# EasyEDA Pro project ProPrj_台灯_2024-11-13.epro

# Schematic Schematic1
Board Name: Board1; Create Date: 2024-10-06
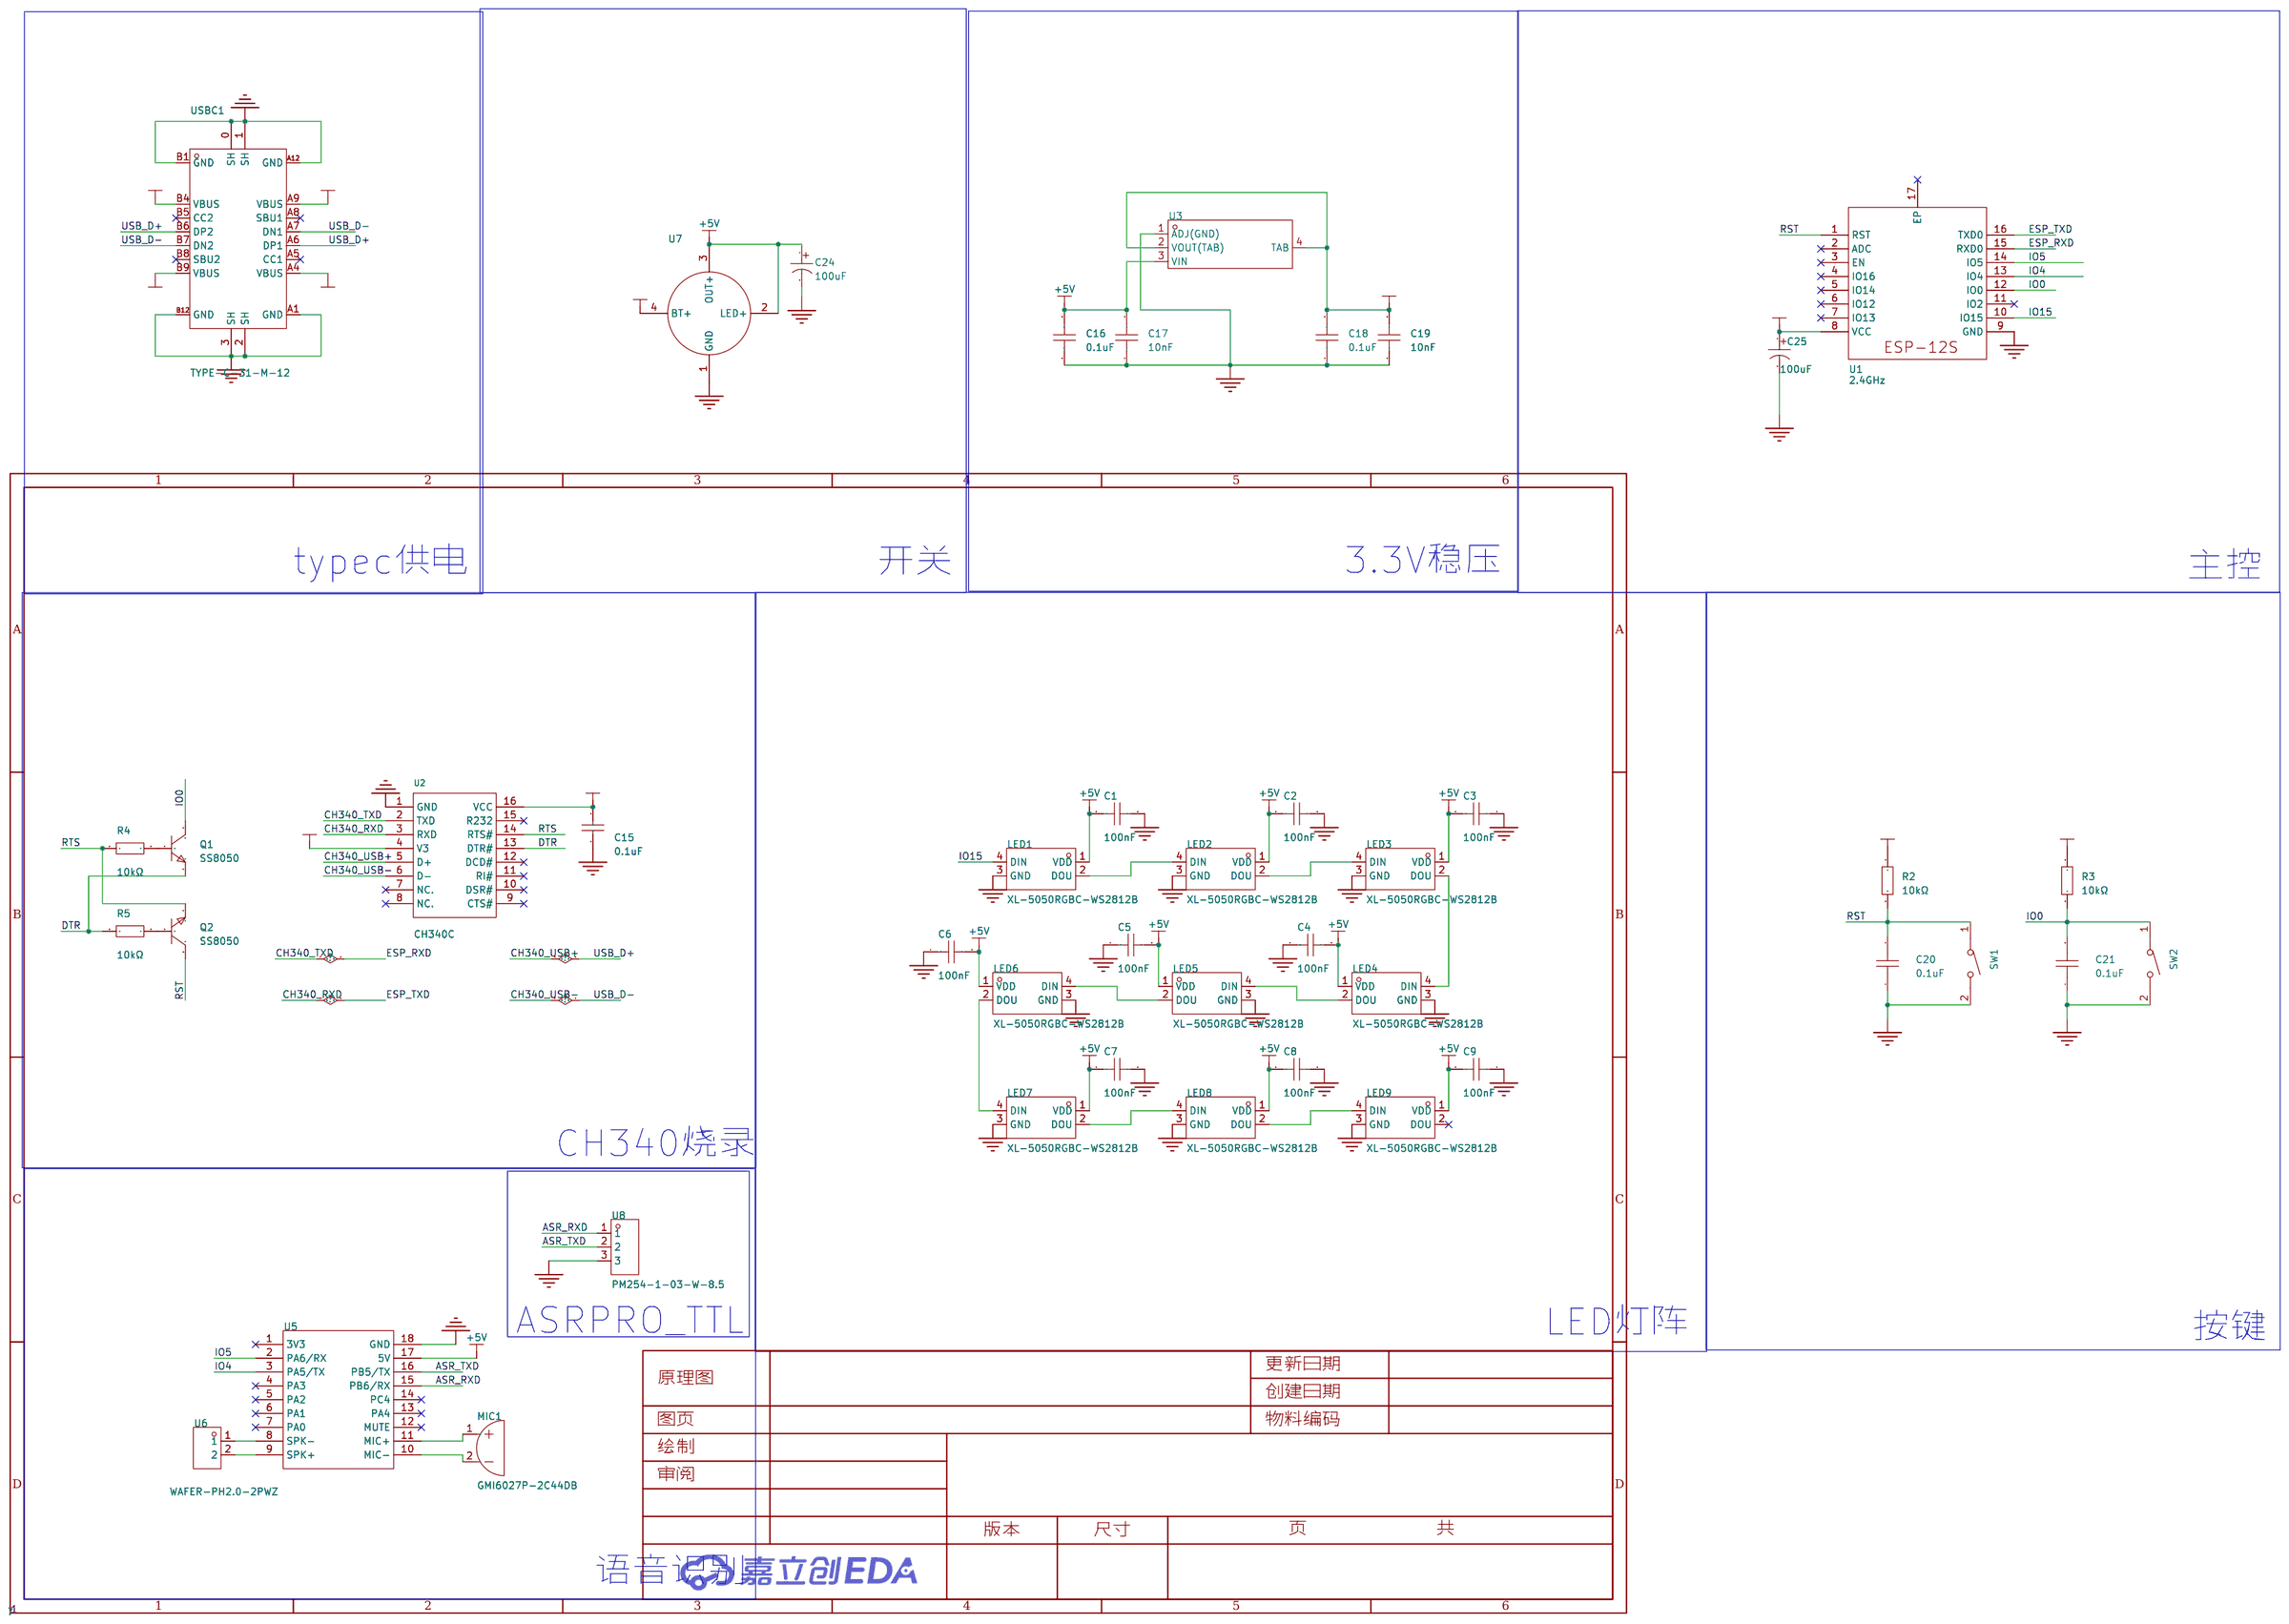
[diagram p0: schematic sheet]

## Parts
C1  100nF  [C0603]
C2  100nF  [C0603]
C3  100nF  [C0603]
C4  100nF  [C0603]
C5  100nF  [C0603]
C6  100nF  [C0603]
C7  100nF  [C0603]
C8  100nF  [C0603]
C9  100nF  [C0603]
C15  0.1uF  [C0603]
C16  0.1uF  [C0603]
C17  10nF  [C0603]
C18  0.1uF  [C0603]
C19  10nF  [C0603]
C20  0.1uF  [C0603]
C21  0.1uF  [C0603]
C24  100uF  [CAP-TH_BD8.0-P3.50-D0.6-FD]
C25  100uF  [CAP-TH_BD8.0-P3.50-D0.6-FD]
LED1  XL-5050RGBC-WS2812B  [LED-SMD_4P-L5.0-W5.0-BL_XL-5050RGBC]
LED2  XL-5050RGBC-WS2812B  [LED-SMD_4P-L5.0-W5.0-BL_XL-5050RGBC]
LED3  XL-5050RGBC-WS2812B  [LED-SMD_4P-L5.0-W5.0-BL_XL-5050RGBC]
LED4  XL-5050RGBC-WS2812B  [LED-SMD_4P-L5.0-W5.0-BL_XL-5050RGBC]
LED5  XL-5050RGBC-WS2812B  [LED-SMD_4P-L5.0-W5.0-BL_XL-5050RGBC]
LED6  XL-5050RGBC-WS2812B  [LED-SMD_4P-L5.0-W5.0-BL_XL-5050RGBC]
LED7  XL-5050RGBC-WS2812B  [LED-SMD_4P-L5.0-W5.0-BL_XL-5050RGBC]
LED8  XL-5050RGBC-WS2812B  [LED-SMD_4P-L5.0-W5.0-BL_XL-5050RGBC]
LED9  XL-5050RGBC-WS2812B  [LED-SMD_4P-L5.0-W5.0-BL_XL-5050RGBC]
MIC1  GMI6027P-2C44DB  [MIC-TH_BD6.0-P1.90-D0.4-L]
Q1  SS8050  [SOT-23-3_L2.9-W1.3-P1.90-LS2.4-BR]
Q2  SS8050  [SOT-23-3_L2.9-W1.3-P1.90-LS2.4-BR]
R2  10kΩ  [R0603]
R3  10kΩ  [R0603]
R4  10kΩ  [R0603]
R5  10kΩ  [R0603]
SW1  TS-1088-AR02016  [SW-SMD_L3.9-W3.0-P4.45]
SW2  TS-1088-AR02016  [SW-SMD_L3.9-W3.0-P4.45]
U1  2.4GHz  [WIRELM-SMD_ESP-12S]
U2  CH340C  [SOP-16_L10.0-W3.9-P1.27-LS6.0-BL]
U3  AMS1117-3.3  [SOT-223-4_L6.5-W3.5-P2.30-LS7.0-BR]
U5  -  [ASRPRO]
U6  WAFER-PH2.0-2PWZ  [CONN-TH_2P-P2.00_GP01-2001WR-2P]
U7  -  [金属开关led]
U8  PM254-1-03-W-8.5  [HDR-TH_3P-P2.54-H-F-W10.0-N]
USBC1  TYPE-C-31-M-12  [USB-C_SMD-TYPE-C-31-M-12]

## Library data of the parts
C1-C9 C16-C19 = CAP_0603: Supplier Footprint: 0603
C15 = 0603F104M500NT: 容值:100nF;精度:±20%;额定电压:50V;材质(温度系数):Y5V;; LCSC Part Name: 100nF ±20% 50V; Supplier Part: C42998; Manufacturer: FH(风华); Supplier Footprint: 0603; JLCPCB Part Class: 扩展库; Datasheet: https://atta.szlcsc.com/upload/public/pdf/source/20170923/C42998_1506149457343988769.pdf; Supplier: LCSC; Tolerance: ±20%; Voltage Rated: 50V; Temperature Coefficient: Y5V
C20 C21 = CC0603KRX7R9BB104: 容值:100nF;精度:±10%;额定电压:50V;材质(温度系数):X7R;; LCSC Part Name: 100nF ±10% 50V; Supplier Part: C14663; Manufacturer: YAGEO(国巨); Supplier Footprint: 0603; JLCPCB Part Class: 基础库; Datasheet: https://atta.szlcsc.com/upload/public/pdf/source/20180910/C282072_33301C7F631E79921B82A8DAC6BCC5B3.pdf; Supplier: LCSC; Tolerance: ±10%; Voltage Rated: 50V; Temperature Coefficient: X7R
C24 C25 = ERS1HM101F12OT: 容值:100uF;精度:±20%;额定电压:50V;; LCSC Part Name: 100uF ±20% 50V; Supplier Part: C112510; Manufacturer: AISHI(艾华集团); Supplier Footprint: 插件,D8xL12mm; JLCPCB Part Class: 扩展库; Datasheet: https://atta.szlcsc.com/upload/public/pdf/source/20191015/C438940_4B8E60A742BB0AE40DDEF87A5C89089D.pdf; Supplier: LCSC; Tolerance: ±20%; Rated Voltage: 50V; Lead Spacing: 3.5mm; φD: 8mm; L: 12mm; Lifetime @ Temp: 7000hrs@105℃
LED1-LED9 = XL-5050RGBC-WS2812B: 发光颜色:RGB三色;二极管配置:-;功率:-;透镜颜色:无色透明透镜;主波长:-;色温:-;发光角度:120°;安装方式:正贴;工作温度:-30℃~+70℃;; LCSC Part Name: RGB三色 正贴 幻彩; Supplier Part: C2843785; Manufacturer: XINGLIGHT(成兴光); Supplier Footprint: SMD5050; JLCPCB Part Class: 扩展库; Datasheet: https://atta.szlcsc.com/upload/public/pdf/source/20230111/86AAD2096485A2E5BCAB883FF8CBE6FD.pdf; Supplier: LCSC; Emitted Color: RGB三色; Lens Color: 无色透明透镜; Peak Wavelength: 625nm；470nm；530nm; Viewing Angle: 120°; Mounting Sytle: 正贴; Operating Temperature: -30℃~+70℃
MIC1 = GMI6027P-2C44DB: LCSC Part Name: 全指向双电容φ6.0*2.7mm 1.5V-10V 灵敏度-44db 低阻抗 针脚; Supplier Part: C233905; Manufacturer: INGHAi(赢海); JLCPCB Part Class: 扩展库; Datasheet: https://atta.szlcsc.com/upload/public/pdf/source/20200113/C233905_D9F806F0F5BE99EA67A86A2015F17646.pdf; Supplier: LCSC
Q1 Q2 = SS8050_C2150: 晶体管类型:NPN;集射极击穿电压(Vceo):25V;集电极电流(Ic):1.5A;功率(Pd):300mW;直流电流增益(hFE@Ic,Vce):200@100mA,1V;; LCSC Part Name: NPN 25V 1.5A Y1 200-350; Supplier Part: C2150; Manufacturer: CJ(江苏长电/长晶); Supplier Footprint: SOT-23; JLCPCB Part Class: 基础库; Datasheet: https://atta.szlcsc.com/upload/public/pdf/source/20230322/AEE86F4B043774EFF80CAEA14A37D9E9.pdf; Supplier: LCSC; Transistor Type: NPN; Collector-Emitter Breakdown Voltage (Vceo): 25V; Collector Current (Ic): 1.5A; Power Dissipation (Pd): 300mW; Collector Cut-Off Current (Icbo): 100nA; Collector-Emitter Saturation Voltage (VCE(sat)@Ic,Ib): 500mV@800mA,80mA; DC Current Gain (hFE@Ic,Vce): 200@100mA,1V; Transition Frequency (fT): 100MHz; Operating Temperature: +150℃@(Tj)
R2-R5 = 0603WAF1002T5E: 电阻类型:厚膜电阻;阻值:10kΩ;精度:±1%;功率:100mW;; LCSC Part Name: 厚膜电阻 10kΩ ±1% 100mW; Supplier Part: C25804; Manufacturer: UNI-ROYAL(厚声); Supplier Footprint: 0603; JLCPCB Part Class: 基础库; Datasheet: https://atta.szlcsc.com/upload/public/pdf/source/20200306/C422600_1E6D84923E4A46A82E41ADD87F860B5C.pdf; Supplier: LCSC; Type: 厚膜电阻; Tolerance: ±1%; Power(Watts): 100mW; Temperature Coefficient: ±100ppm/℃; Overload Voltage (Max): 75V; Operating Temperature Range: -55℃~+155℃
SW1 SW2 = TS-1088-AR02016: 电路结构:单刀单掷;带支架:否;触点电流:50mA;额定电压(DC):12V;安装方式:立贴;绝缘电阻:100MΩ;作用力:160gf@±50gf;机械寿命:10万次;; LCSC Part Name: 4*3*2mm 立贴 轻触开关; Supplier Part: C720477; Manufacturer: XUNPU(讯普); Supplier Footprint: SMD; JLCPCB Part Class: 扩展库; Datasheet: https://atta.szlcsc.com/upload/public/pdf/source/20200810/C720475_60D09DD6C54279ADDB2DC25100F1CC11.pdf; Supplier: LCSC; Circuit: 单刀单掷; Actuator Style: 圆形按钮; Switch Length: 4mm; Switch Width: 3mm; Switch Height: 2mm; Strike Gundam: 否; Contact Current: 50mA; Voltage Rating (DC): 12V; Mounting Style: 立贴; Insulation Resistance: 100MΩ; Actuator/Cap Color: 黑色; Operating Force: 160gf@±50gf; Pin Style: SMD接片; Mechanical Life: 10万次; Operating Temperature: -30℃~+80℃
U1 = ESP-12S: 频率:2.4GHz;发射功率:16dBm;核心处理器:ESP32;天线形式:PCB 板载天线;接收灵敏度:-90dBm;; Supplier Part: C82898; Manufacturer: Ai-Thinker(安信可); Supplier Footprint: SMD,16x24mm; JLCPCB Part Class: 扩展库; Datasheet: https://atta.szlcsc.com/upload/public/pdf/source/20180726/C82898_9FA1708C134FC93491C81360A8B073B0.pdf; Supplier: LCSC; Output Power: 16dBm; Core Processor: ESP32; Support Interface: GPIO；UART；PWM；ADC; Antenna Type: PCB 板载天线; Wireless Standard: 802.11b/g/n; Operating Voltage: 3.3V; Receive  Current: 56mA; Send  Current: 170mA; Sensitivity: -90dBm; Operating Temperature: -20℃~+85℃
U2 = CH340C: 应用功能:收发器;接口协议:USB 2.0;数据速率:2Mbps;; LCSC Part Name: CH340C USB转串口芯片 CH340; Supplier Part: C84681; Manufacturer: WCH(南京沁恒); Supplier Footprint: SOP-16; JLCPCB Part Class: 扩展库; Datasheet: https://atta.szlcsc.com/upload/public/pdf/source/20200819/C84681_ADBED554CE321879DBD6B1D06488689C.pdf; Supplier: LCSC; Applications Function: 收发器; Protocol: USB 2.0; Data Rate: 2Mbps; Supply Voltage: 3.3V；5V
U3 = AMS1117-3.3_C347222: 输出类型:固定;最大输入电压:18V;输出电压:3.3V;输出电流:1A;电源纹波抑制比(PSRR):60dB@(120Hz);输出极性:正;; LCSC Part Name: 输入18V 输出3.3V 1A; Supplier Part: C347222; Manufacturer: UMW(友台半导体); Supplier Footprint: SOT-223; JLCPCB Part Class: Extended Part; Datasheet: https://atta.szlcsc.com/upload/public/pdf/source/20231109/155D79A26D9DB04352555A58D5969DC8.pdf; Supplier: LCSC; Output Type: 固定; Output Polarity: 正; Number of Outputs: 1; Maximum Input Voltage: 18V; Output Voltage: 3.3V; Dropout Voltage: 1.3V@(1A); Output Current: 1A; Power Supply Rejection Ratio (PSRR): 60dB@(120Hz)
U5 = ASRPRO
U6 = WAFER-PH2.0-2PWZ: 插针结构:1x2P;间距:2mm;安装方式:弯插;参考系列:PH;总PIN数:2P;排数:1;每排PIN数:2;额定电流:2A;工作温度范围:-25℃~+85℃;; LCSC Part Name: PH 2.0mm 1x2P 弯插; Supplier Part: C5359610; Manufacturer: XUNPU(讯普); Supplier Footprint: 弯插,P=2mm; JLCPCB Part Class: Extended Part; Datasheet: https://atta.szlcsc.com/upload/public/pdf/source/20230728/47B07572F36CD4F6F91BE29B817CECA3.pdf; Supplier: LCSC; Pins Structure: 1x2P; Pitch: 2mm; Mounting Style: 弯插; Reference Series: PH; Number of Pins: 2P; Number of Rows: 1; Number of PINs Per Row: 2; Current Rating (Max): 2A; Operating Temperature Range: -25℃~+85℃
U7 = 金属led开关
U8 = PM254-1-03-W-8.5: 插孔结构:1x3P;间距:2.54mm;行距:-;圆孔/方孔:方孔;安装类型:弯插;排数:单排;总孔位数:3P;额定电流:3A;额定电压:-;插孔方向:侧面;塑高:8.5mm;触头材质:铜合金;工作温度范围:-40℃~+105℃;焊接温度(最大值):260℃@5S;; LCSC Part Name: 1x3P 间距:2.54mm 弯插; Supplier Part: C2897385; Manufacturer: HCTL(华灿天禄); Supplier Footprint: 弯插,P=2.54mm; JLCPCB Part Class: 扩展库; Datasheet: https://atta.szlcsc.com/upload/public/pdf/source/20230609/7BA40A3D721268A082DCDEAD4C99131B.pdf; Supplier: LCSC; Holes Structure: 1x3P; Pitch: 2.54mm; Circular Hole / Square Hole: 方孔; Mounting Type: 弯插; Number of Rows: 单排; Number of Holes: 3P; Current Rating (Max): 3A; Holes Direction: 侧面; Insulation Height: 8.5mm; Contact Material: 铜合金; Operating Temperature Range: -40℃~+105℃; Soldering Temperature(Max): 260℃@5S
USBC1 = TYPE-C-31-M-12: 连接器类型:Type-C;标准:-;公母:母;安装方式:-;触点数量:16P;端口数量:1;额定电流 - 电源:5A;触头材质:-;触头镀层:-;工作温度范围:-;焊接温度(最大值):-;; LCSC Part Name: Type-C 母; Supplier Part: C165948; Manufacturer: 韩国韩荣; Supplier Footprint: SMD; JLCPCB Part Class: 扩展库; Datasheet: https://atta.szlcsc.com/upload/public/pdf/source/20220525/466408E853115E789EDB0DDC29077C05.pdf; Supplier: LCSC; Connector Type: Type-C; Gender: 母; Number of Contacts: 16P; Number of Ports: 1; Current Rating - Power (Max): 5A

## Nets
3V3: C15.2 C18.2 C19.2 C25.1 R2.1 R3.1 U1.8(VCC) U2.4(V3) U2.16(VCC) U3.2(VOUT(TAB)) U3.4(TAB)
+5V: C1.2 C2.2 C3.2 C4.2 C5.2 C6.2 C7.2 C8.2 C9.2 C16.2 C17.2 C24.1 LED1.1(VDD) LED2.1(VDD) LED3.1(VDD) LED4.1(VDD) LED5.1(VDD) LED6.1(VDD) LED7.1(VDD) LED8.1(VDD) LED9.1(VDD) U3.3(VIN) U5.17(5V) U7.2(LED+) U7.3(OUT+)
+5VIN: U7.4(BT+) USBC1.A4(VBUS) USBC1.A9(VBUS) USBC1.B4(VBUS) USBC1.B9(VBUS)
GND: C1.1 C2.1 C3.1 C4.1 C5.1 C6.1 C7.1 C8.1 C9.1 C15.1 C16.1 C17.1 C18.1 C19.1 C20.1 C21.1 C24.2 C25.2 LED1.3(GND) LED2.3(GND) LED3.3(GND) LED4.3(GND) LED5.3(GND) LED6.3(GND) LED7.3(GND) LED8.3(GND) LED9.3(GND) SW1.2 SW2.2 U1.9(GND) U2.1(GND) U3.1(ADJ(GND)) U5.18(GND) U7.1(GND) U8.3 USBC1.0(SH) USBC1.1(SH) USBC1.2(SH) USBC1.3(SH) USBC1.A1(GND) USBC1.A12(GND) USBC1.B1(GND) USBC1.B12(GND)
ASR_RXD: U5.15(PB6/RX) U8.1
ASR_TXD: U5.16(PB5/TX) U8.2
CH340_RXD: U1.16(TXD0) U2.3(RXD)
CH340_TXD: U1.15(RXD0) U2.2(TXD)
CH340_USB+: U2.5(D+) USBC1.A6(DP1) USBC1.B6(DP2)
CH340_USB-: U2.6(D-) USBC1.A7(DN1) USBC1.B7(DN2)
DTR: Q1.2(E) R5.1 U2.13(DTR#)
IO0: C21.2 Q1.3(C) R3.2 SW2.1 U1.12(IO0)
IO4: U1.13(IO4) U5.3(PA5/TX)
IO5: U1.14(IO5) U5.2(PA6/RX)
IO15: LED1.4(DIN) U1.10(IO15)
RST: C20.2 Q2.3(C) R2.2 SW1.1 U1.1(RST)
RTS: Q2.2(E) R4.1 U2.14(RTS#)
$1N1426: LED7.2(DOU) LED8.4(DIN)
$1N1428: LED6.2(DOU) LED7.4(DIN)
$1N1430: LED3.2(DOU) LED4.4(DIN)
$1N1444: LED8.2(DOU) LED9.4(DIN)
$1N1450: LED5.2(DOU) LED6.4(DIN)
$1N1453: LED4.2(DOU) LED5.4(DIN)
$1N1461: LED1.2(DOU) LED2.4(DIN)
$1N1466: LED2.2(DOU) LED3.4(DIN)
$1N2556: Q1.1(B) R4.2
$1N2557: Q2.1(B) R5.2
$1N4217: MIC1.1 U5.11(MIC+)
$1N4222: MIC1.2 U5.10(MIC-)
$1N4406: U5.9(SPK+) U6.2
$1N4408: U5.8(SPK-) U6.1

Not connected (* = marked no-connect by the designer): LED9 2(DOU)*; U1 2(ADC)* 3(EN)* 4(IO16)* 5(IO14)* 6(IO12)* 7(IO13)* 11(IO2)* 17(EP)*; U2 7(NC.)* 8(NC.)* 9(CTS#)* 10(DSR#)* 11(RI#)* 12(DCD#)* 15(R232)*; U5 1(3V3)* 4(PA3)* 5(PA2)* 6(PA1)* 7(PA0)* 12(MUTE)* 13(PA4)* 14(PC4)*; USBC1 A5(CC1)* A8(SBU1)* B5(CC2)* B8(SBU2)*

## Notes on the sheet
- typec供电
- 开关
- 3.3V稳压
- 主控
- CH340烧录
- ASRPRO_TTL
- LED灯阵
- 按键
- 语音识别

# Board PCB1
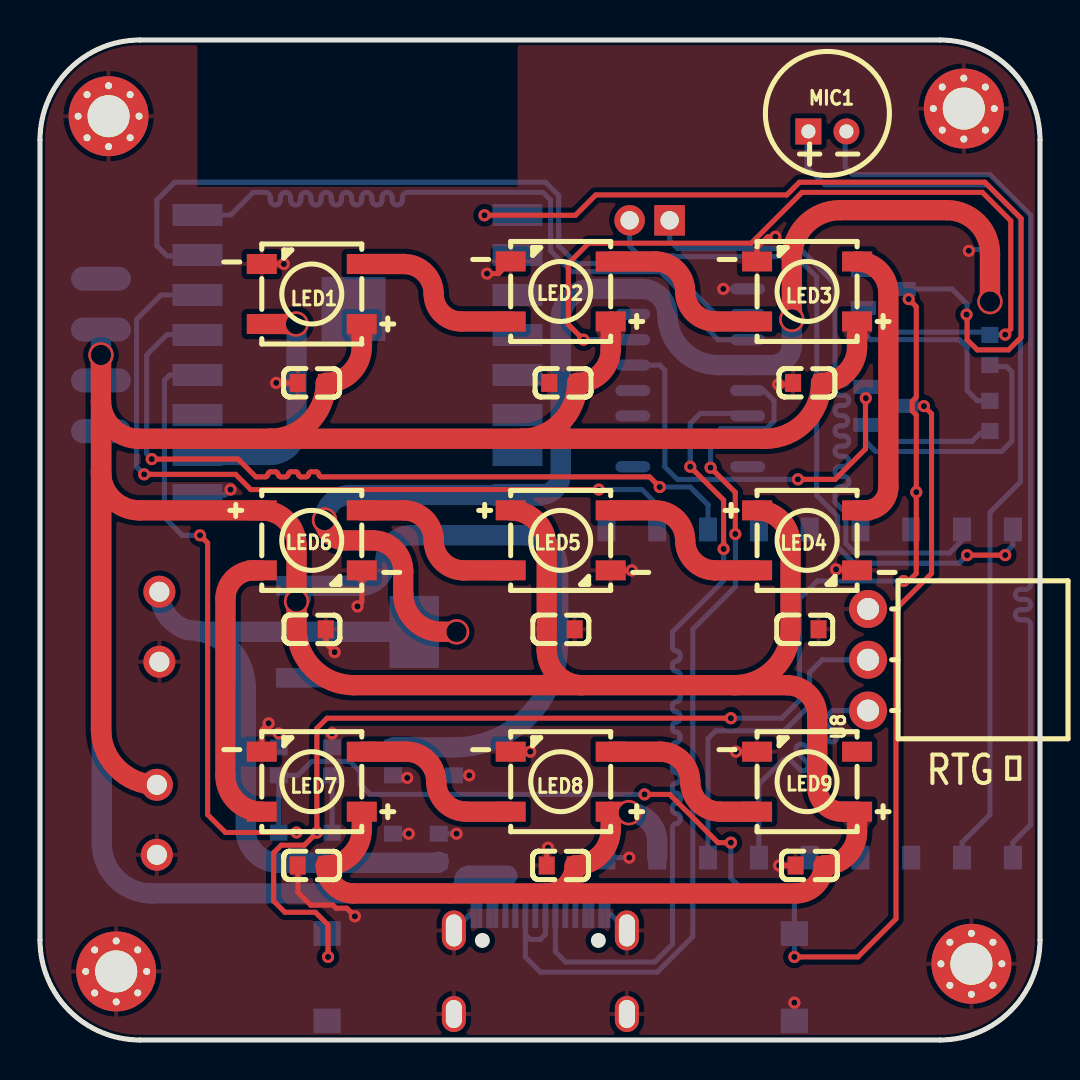
[diagram p1: board, top side]
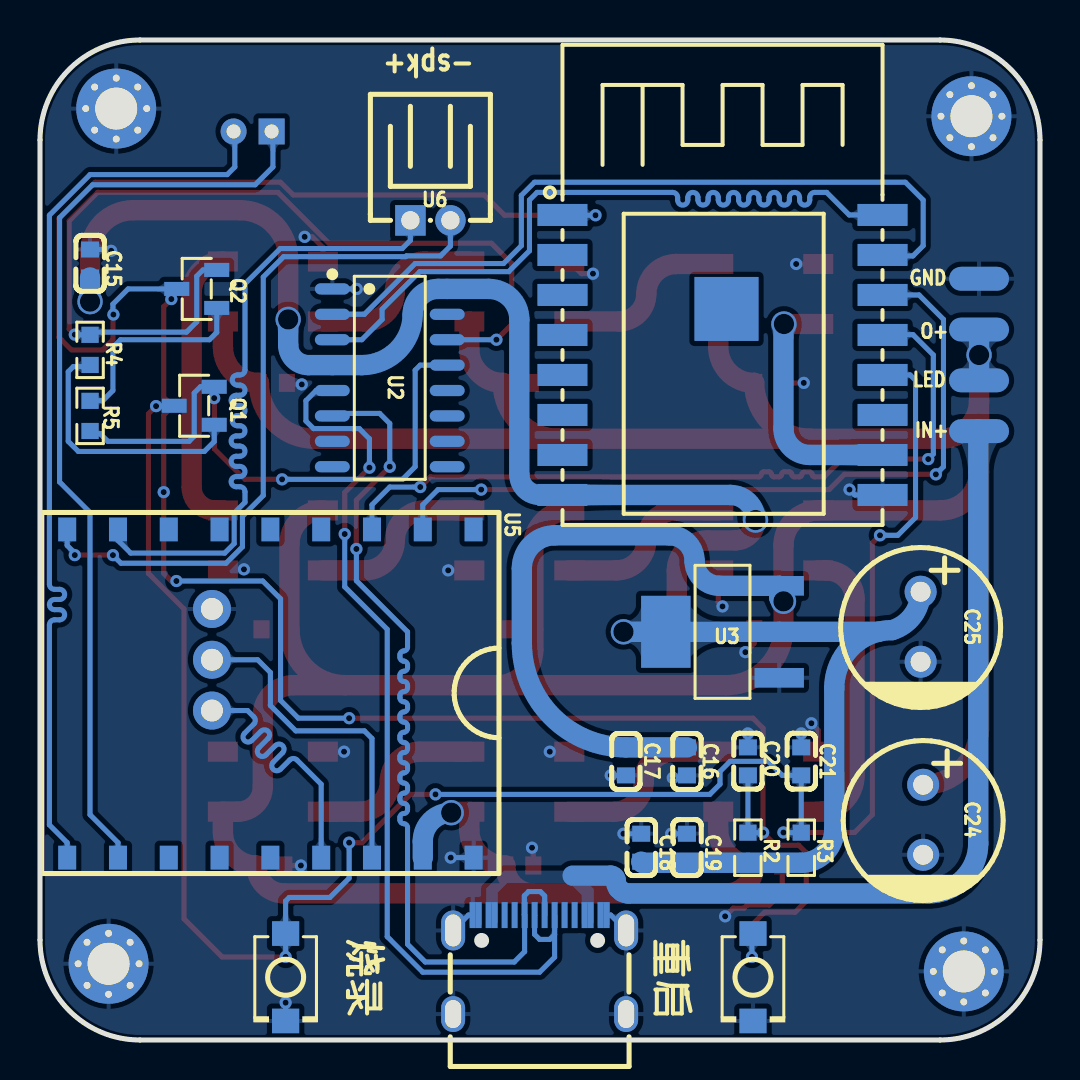
[diagram p2: board, bottom side, seen from below]

Outline 50 x 50 mm; copper layers: Top Layer, Bottom Layer. Coordinates in mm from the lower left corner of the outline.
Outline path: 0,45 0,5 arc(1.46,1.46) 5,0 45,0 arc(48.54,1.46) 50,5 50,45 arc(48.54,48.54) 45,50 5,50 arc(1.46,48.54) 0,45
Stack: Top Layer 0.035mm / Dielectric1 1.51mm FR4 er 4.5 / Bottom Layer 0.035mm

## Design rules (mm)
net CH340_RXD: DP1
net CH340_TXD: DP1
net CH340_USB+: DP2
net CH340_USB-: DP2
net ASR_RXD: DP3
net ASR_TXD: DP3
net $1N4222: DP6
net $1N4217: DP6
net $1N4406: DP5
net $1N4408: DP5
net IO5: DP4
net IO4: DP4
template: JLCPCB Capability(Two Layers Board)
spacing copperThickness1oz (default): track to track 0.102, other pairs 0.152 to 0.3
spacing copperThickness2oz: track to track 0.203, other pairs 0.152 to 0.3
track width copperThickness1oz (default): min 0.127, default 0.254, max 2.54
track width copperThickness2oz: min 0.203, default 0.254, max 2.54
differential pair differentialPair (default): width min 0.127, default 0.254, max 2.54; gap min 0.152, default 0.152
via viaSize (default): diameter min 0.5, default 0.61, max 10; hole min 0.3, default 0.305, max 6.3

## Placement (name value [footprint] x y rotation side)
C1  100nF  [C0603]  13.59 32.85 0 top
C2  100nF  [C0603]  26.16 32.85 0 top
C3  100nF  [C0603]  38.35 32.85 0 top
C4  100nF  [C0603]  13.59 20.54 180 top
C5  100nF  [C0603]  26.03 20.54 180 top
C6  100nF  [C0603]  38.23 20.54 180 top
C7  100nF  [C0603]  13.59 8.72 0 top
C8  100nF  [C0603]  26.03 8.72 0 top
C9  100nF  [C0603]  38.48 8.72 0 top
C15  0.1uF  [C0603]  47.5 38.82 270 bottom
C16  0.1uF  [C0603]  17.65 13.93 90 bottom
C17  10nF  [C0603]  20.7 13.93 90 bottom
C18  0.1uF  [C0603]  19.94 9.61 270 bottom
C19  10nF  [C0603]  17.65 9.61 270 bottom
C20  0.1uF  [C0603]  14.61 13.93 270 bottom
C21  0.1uF  [C0603]  11.94 13.93 270 bottom
C24  100uF  [CAP-TH_BD8.0-P3.50-D0.6-FD]  5.84 11.01 270 bottom
C25  100uF  [CAP-TH_BD8.0-P3.50-D0.6-FD]  5.97 20.66 270 bottom
LED1  XL-5050RGBC-WS2812B  [LED-SMD_4P-L5.0-W5.0-BL_XL-5050RGBC]  13.59 37.3 90 top
LED2  XL-5050RGBC-WS2812B  [LED-SMD_4P-L5.0-W5.0-BL_XL-5050RGBC]  26.03 37.43 90 top
LED3  XL-5050RGBC-WS2812B  [LED-SMD_4P-L5.0-W5.0-BL_XL-5050RGBC]  38.35 37.43 90 top
LED4  XL-5050RGBC-WS2812B  [LED-SMD_4P-L5.0-W5.0-BL_XL-5050RGBC]  38.35 24.98 270 top
LED5  XL-5050RGBC-WS2812B  [LED-SMD_4P-L5.0-W5.0-BL_XL-5050RGBC]  26.03 24.98 270 top
LED6  XL-5050RGBC-WS2812B  [LED-SMD_4P-L5.0-W5.0-BL_XL-5050RGBC]  13.59 24.98 270 top
LED7  XL-5050RGBC-WS2812B  [LED-SMD_4P-L5.0-W5.0-BL_XL-5050RGBC]  13.59 12.92 90 top
LED8  XL-5050RGBC-WS2812B  [LED-SMD_4P-L5.0-W5.0-BL_XL-5050RGBC]  26.03 12.92 90 top
LED9  XL-5050RGBC-WS2812B  [LED-SMD_4P-L5.0-W5.0-BL_XL-5050RGBC]  38.35 12.92 90 top
MIC1  GMI6027P-2C44DB  [MIC-TH_BD6.0-P1.90-D0.4-L]  39.37 45.43 0 top
NOREF  -  [Pad_e380]  45.11 45.49 270 top
NOREF#2  -  [Pad_e401]  3.81 1.91 90 top
NOREF#3  -  [Pad_e400]  45.05 3.81 180 top
NOREF#4  -  [Pad_e390]  46.57 2.29 180 top
NOREF#5  -  [Pad_e6104]  3.43 44.67 0 top
NOREF#6  -  [Pad_e376]  47.27 47.65 270 top
NOREF#7  -  [Pad_e414]  3.81 4.95 90 top
NOREF#8  -  [Pad_e393]  46.57 3.81 180 top
NOREF#9  -  [Pad_e375]  45.11 47.65 270 top
NOREF#10  -  [Pad_e6102]  1.91 46.19 0 top
NOREF#11  -  [Pad_e413]  2.73 4.51 90 top
NOREF#12  -  [Pad_e407]  3.81 3.43 90 top
NOREF#13  -  [Pad_e396]  45.49 2.73 180 top
NOREF#14  -  [Pad_e379]  44.67 46.57 270 top
NOREF#15  -  [Pad_e6101]  2.35 47.27 0 top
NOREF#16  -  [Pad_e374]  46.19 48.09 270 top
NOREF#17  -  [Pad_e6100]  3.43 47.71 0 top
NOREF#18  -  [Pad_e394]  46.57 5.33 180 top
NOREF#19  -  [Pad_e402]  4.89 2.35 90 top
NOREF#20  -  [Pad_e395]  45.49 4.89 180 top
NOREF#21  -  [Pad_e6107]  4.51 47.27 0 top
NOREF#22  -  [Pad_e378]  46.19 46.57 270 top
NOREF#23  -  [Pad_e381]  47.27 45.49 270 top
NOREF#24  -  [Pad_e387]  48.09 3.81 180 top
NOREF#25  -  [Pad_e6099]  3.43 46.19 0 top
NOREF#26  -  [Pad_e377]  47.71 46.57 270 top
NOREF#27  -  [Pad_e6103]  2.35 45.11 0 top
NOREF#28  -  [Pad_e411]  5.33 3.43 90 top
NOREF#29  -  [Pad_e6106]  4.95 46.19 0 top
NOREF#30  -  [Pad_e388]  47.65 4.89 180 top
NOREF#31  -  [Pad_e406]  2.29 3.43 90 top
NOREF#32  -  [Pad_e412]  4.89 4.51 90 top
NOREF#33  -  [Pad_e6105]  4.51 45.11 0 top
NOREF#34  -  [Pad_e385]  46.19 45.05 270 top
NOREF#35  -  [Pad_e403]  2.73 2.35 90 top
NOREF#36  -  [Pad_e389]  47.65 2.73 180 top
Q1  SS8050  [SOT-23-3_L2.9-W1.3-P1.90-LS2.4-BR]  42.29 31.71 180 bottom
Q2  SS8050  [SOT-23-3_L2.9-W1.3-P1.90-LS2.4-BR]  42.16 37.55 180 bottom
R2  10kΩ  [R0603]  14.61 9.61 90 bottom
R3  10kΩ  [R0603]  11.94 9.61 90 bottom
R4  10kΩ  [R0603]  47.5 34.51 270 bottom
R5  10kΩ  [R0603]  47.5 31.2 90 bottom
SW1  TS-1088-AR02016  [SW-SMD_L3.9-W3.0-P4.45]  14.35 3.14 270 bottom
SW2  TS-1088-AR02016  [SW-SMD_L3.9-W3.0-P4.45]  37.72 3.14 270 bottom
U1  2.4GHz  [WIRELM-SMD_ESP-12S]  15.88 34.25 180 bottom
U2  CH340C  [SOP-16_L10.0-W3.9-P1.27-LS6.0-BL]  32.51 33.11 270 bottom
U3  AMS1117-3.3  [SOT-223-4_L6.5-W3.5-P2.30-LS7.0-BR]  15.88 20.41 180 bottom
U5  -  [ASRPRO]  27.05 26.12 270 bottom
U6  WAFER-PH2.0-2PWZ  [CONN-TH_2P-P2.00_GP01-2001WR-2P]  30.48 40.98 180 bottom
U7  -  [金属开关led]  3.05 34.25 0 top
U8  PM254-1-03-W-8.5  [HDR-TH_3P-P2.54-H-F-W10.0-N]  41.4 19.01 90 top
USBC1  TYPE-C-31-M-12  [USB-C_SMD-TYPE-C-31-M-12]  25.02 3.77 180 bottom

## Footprints (pads in the part's own frame, mm; a bottom-side part is the same pattern mirrored in y, then rotated)
ASRPRO
  rect 1.19x0.9 smd: 1(0.595,-1.27) 2(0.595,-3.81) 3(0.595,-6.35) 4(0.595,-8.89) 5(0.595,-11.43) 6(0.595,-13.97) 7(0.595,-16.51) 8(0.595,-19.05) 9(0.595,-21.59) 10(17.005,-21.59) 11(17.005,-19.05) 12(17.005,-16.51) 13(17.005,-13.97) 14(17.005,-11.43) 15(17.005,-8.89) 16(17.005,-6.35) 17(17.005,-3.81) 18(17.005,-1.27)
C0603
  rect 0.8x0.9 smd: 1(-0.7,0) 2(0.7,0)
CAP-TH_BD8.0-P3.50-D0.6-FD
  round 1.6 hole 1: 1(-1.75,0) 2(1.75,0)
CONN-TH_2P-P2.00_GP01-2001WR-2P
  rect 1.524x1.524 hole 0.914: 1(-1,0)
  round 1.524 hole 0.914: 2(1,0)
HDR-TH_3P-P2.54-H-F-W10.0-N
  round 1.9 hole 1.1: 1(-2.54,0) 2(0,0) 3(2.54,0)
LED-SMD_4P-L5.0-W5.0-BL_XL-5050RGBC
  rect 1x1.5 smd: 1(-1.5,-2.5) 2(1.5,-2.5) 3(1.5,2.5) 4(-1.5,2.5)
MIC-TH_BD6.0-P1.90-D0.4-L
  rect 1.3x1.3 hole 0.7: 1(-0.95,0)
  round 1.3 hole 0.7: 2(0.95,0)
Pad_e374
  round 0.5 hole 0.35: 19(0,0)
Pad_e375
  round 0.5 hole 0.35: 20(0,0)
Pad_e376
  round 0.5 hole 0.35: 2(0,0)
Pad_e377
  round 0.5 hole 0.35: 1(0,0)
Pad_e378
  round 4 hole 2.1: 1(0,0)
Pad_e379
  round 0.5 hole 0.35: 21(0,0)
Pad_e380
  round 0.5 hole 0.35: 22(0,0)
Pad_e381
  round 0.5 hole 0.35: 24(0,0)
Pad_e385
  round 0.5 hole 0.35: 23(0,0)
Pad_e387
  round 0.5 hole 0.35: 19(0,0)
Pad_e388
  round 0.5 hole 0.35: 20(0,0)
Pad_e389
  round 0.5 hole 0.35: 2(0,0)
Pad_e390
  round 0.5 hole 0.35: 1(0,0)
Pad_e393
  round 4 hole 2.1: 1(0,0)
Pad_e394
  round 0.5 hole 0.35: 21(0,0)
Pad_e395
  round 0.5 hole 0.35: 22(0,0)
Pad_e396
  round 0.5 hole 0.35: 24(0,0)
Pad_e400
  round 0.5 hole 0.35: 23(0,0)
Pad_e401
  round 0.5 hole 0.35: 19(0,0)
Pad_e402
  round 0.5 hole 0.35: 20(0,0)
Pad_e403
  round 0.5 hole 0.35: 2(0,0)
Pad_e406
  round 0.5 hole 0.35: 1(0,0)
Pad_e407
  round 4 hole 2.1: 1(0,0)
Pad_e411
  round 0.5 hole 0.35: 21(0,0)
Pad_e412
  round 0.5 hole 0.35: 22(0,0)
Pad_e413
  round 0.5 hole 0.35: 24(0,0)
Pad_e414
  round 0.5 hole 0.35: 23(0,0)
Pad_e6099
  round 4 hole 2.1: 1(0,0)
Pad_e6100
  round 0.5 hole 0.35: 1(0,0)
Pad_e6101
  round 0.5 hole 0.35: 2(0,0)
Pad_e6102
  round 0.5 hole 0.35: 19(0,0)
Pad_e6103
  round 0.5 hole 0.35: 20(0,0)
Pad_e6104
  round 0.5 hole 0.35: 21(0,0)
Pad_e6105
  round 0.5 hole 0.35: 22(0,0)
Pad_e6106
  round 0.5 hole 0.35: 23(0,0)
Pad_e6107
  round 0.5 hole 0.35: 24(0,0)
R0603
  rect 0.806x0.864 smd: 1(-0.753,0) 2(0.753,0)
SOP-16_L10.0-W3.9-P1.27-LS6.0-BL
  oval 0.56x1.745 smd: 1(-4.445,-2.873) 2(-3.175,-2.873) 3(-1.905,-2.873) 4(-0.635,-2.873) 5(0.635,-2.873) 6(1.905,-2.873) 7(3.175,-2.873) 8(4.445,-2.873) 9(4.445,2.873) 10(3.175,2.873) 11(1.905,2.873) 12(0.635,2.873) 13(-0.635,2.873) 14(-1.905,2.873) 15(-3.175,2.873) 16(-4.445,2.873)
SOT-23-3_L2.9-W1.3-P1.90-LS2.4-BR
  rect 1.25x0.7 smd: 1(1,-0.95) 2(1,0.95) 3(-1,0)
SOT-223-4_L6.5-W3.5-P2.30-LS7.0-BR
  rect 2.47x0.98 smd: 1(2.835,-2.3) 2(2.835,0) 3(2.835,2.3)
  rect 2.47x3.6 smd: 4(-2.835,0)
SW-SMD_L3.9-W3.0-P4.45
  rect 1.23x1.36 smd: 1(-2.185,0) 2(2.185,0)
USB-C_SMD-TYPE-C-31-M-12
  oval 1.2x2 hole 0.8x1.6: 0(-4.325,1.706) 1(4.325,1.706)
  oval 1.2x1.8 hole 0.8x1.4: 2(4.325,-2.474) 3(-4.325,-2.474)
  rect 0.3x1.3 smd: A1(-3.35,2.474) A4(-2.55,2.474) A5(-1.25,2.474) A6(-0.25,2.474) A7(0.25,2.474) A8(1.25,2.474) A9(2.55,2.474) A12(3.35,2.474) B1(3.05,2.474) B4(2.25,2.474) B5(1.75,2.474) B6(0.75,2.474) B7(-0.75,2.474) B8(-1.75,2.474) B9(-2.25,2.474) B12(-3.05,2.474)
WIRELM-SMD_ESP-12S
  rect 2.5x1.1 smd: 1(-8.002,7) 2(-8.002,5) 3(-8,3) 4(-8.002,1) 5(-8.002,-1) 6(-8.002,-3) 7(-8.002,-5) 8(-8.001,-7) 9(8.001,-7) 10(8,-5) 11(8.001,-3) 12(8,-1) 13(8.001,1) 14(8.002,3) 15(8.001,5) 16(8,7)
  rect 3.2x3.2 smd: 17(0.2,2.3)
金属开关led
  rrect 3x1.2 smd far side: 1(0,3.81) 2(0,1.27) 3(0,-1.27) 4(0,-3.81)

## Nets
As in the schematic, except:
GND: C1.1 C2.1 C3.1 C4.1 C5.1 C6.1 C7.1 C8.1 C9.1 C15.1 C16.1 C17.1 C18.1 C19.1 C20.1 C21.1 C24.2 C25.2 LED1.3 LED2.3 LED3.3 LED4.3 LED5.3 LED6.3 LED7.3 LED8.3 LED9.3 NOREF.22 NOREF#2.19 NOREF#3.23 NOREF#4.1 NOREF#5.21 NOREF#6.2 NOREF#7.23 NOREF#8.1 NOREF#9.20 NOREF#10.19 NOREF#11.24 NOREF#12.1 NOREF#13.24 NOREF#14.21 NOREF#15.2 NOREF#16.19 NOREF#17.1 NOREF#18.21 NOREF#19.20 NOREF#20.22 NOREF#21.24 NOREF#22.1 NOREF#23.24 NOREF#24.19 NOREF#25.1 NOREF#26.1 NOREF#27.20 NOREF#28.21 NOREF#29.23 NOREF#30.20 NOREF#31.1 NOREF#32.22 NOREF#33.22 NOREF#34.23 NOREF#35.2 NOREF#36.2 SW1.2 SW2.2 U1.9 U2.1 U3.1 U5.18 U7.1 U8.3 USBC1.0 USBC1.1 USBC1.2 USBC1.3 USBC1.A1 USBC1.A12 USBC1.B1 USBC1.B12

Pads without a net: LED9 2; U1 2 3 4 5 6 7 11 17; U2 7 8 9 10 11 12 15; U5 1 4 5 6 7 12 13 14; USBC1 A5 A8 B5 B8

## Via types
v1: diameter 1.27, hole 1.016, Top Layer to Bottom Layer, 8 vias
v2: diameter 0.61, hole 0.305, Top Layer to Bottom Layer, 54 vias

## Routing (per net, layer and track width the routed paths; a pad name or vN(x,y) marks a point on that pad's centre or on a via; arc(x,y) is an arc through that point)
3V3: length 104.2
  Top Layer w1.016: v1(37.59,36.03) 37.59,39.08 arc(38.3,40.78) 40,41.49 45.34,41.49 arc(46.87,40.86) 47.5,39.33 47.5,37.05 ; v1(20.83,20.41) 20.07,20.41 arc(18.72,20.97) 18.16,22.31 18.16,23.46 arc(17.71,24.53) 16.64,24.98 15.24,24.98 arc(14.52,25.28) v1(14.22,26)
  Bottom Layer w1.016: 8.09,20.41 U3.2 U3.4 v1(20.83,20.41) ; 8.09,20.41 arc(9.67,19.39) 10.29,17.61 10.29,10.51 arc(10.77,9.34) R3.1 R2.1 19.89,8.86 C18.2 ; 8.09,20.41 arc(7.75,20.47) 7.4,20.49 arc(6.37,21.21) C25.1 ; v1(47.5,36.92) C15.2 ; v1(37.59,36.03) 37.59,34.76 arc(37.29,34.04) 36.58,33.74 U2.4 33.91,33.74 arc(32.11,34.49) 31.37,36.28 arc(31,37.18) 30.1,37.55 27.56,37.55 arc(26.48,37.11) 26.03,36.03 26.03,28.28 arc(25.73,27.55) 25,27.25 U1.8 15.48,27.25 arc(14.59,26.88) v1(14.22,26)
+5V: length 232
  Top Layer w1.016: 25.34,7.33 15.69,7.33 arc(14.7,7.74) C7.2 arc(15.56,9.25) 16.09,10.52 LED7.1 ; 25.34,7.33 37.78,7.33 arc(38.77,7.74) C9.2 arc(40.36,9.22) 40.85,10.4 LED9.1 40.11,11.42 arc(39.23,11.78) 38.86,12.66 38.86,16.22 arc(38.42,17.3) 37.34,17.74 34.73,17.74 ; 25.34,7.33 arc(26.33,7.74) C8.2 arc(28.01,9.25) 28.53,10.52 LED8.1 ; 3.05,31.97 v1(3.05,34.25) ; 3.05,31.97 3.05,28.41 ; 3.05,31.97 arc(3.61,30.62) 4.95,30.06 11.5,30.06 ; 3.05,28.41 3.05,15.55 arc(3.87,13.58) C24.1 ; 3.05,28.41 arc(3.61,27.05) 4.98,26.48 LED6.1 arc(12.32,25.97) 12.83,24.74 v1(12.83,21.93) 12.83,20.6 arc(13.66,18.58) 15.68,17.74 27.1,17.74 ; 24.07,30.06 36.26,30.06 arc(38.24,30.88) C3.2 arc(40.33,33.38) 40.85,34.66 LED3.1 ; 24.07,30.06 11.5,30.06 ; 24.07,30.06 arc(26.04,30.88) C2.2 arc(28.04,33.35) 28.53,34.53 LED2.1 ; 27.1,17.74 34.73,17.74 ; 27.1,17.74 arc(25.85,18.26) 25.34,19.5 C5.2 25.34,24.68 arc(24.81,25.95) LED5.1 ; 34.73,17.74 arc(36.71,18.56) C6.2 37.53,24.81 arc(37.04,25.99) LED4.1 ; LED1.1 16.09,34.66 arc(15.56,33.38) C1.2 arc(13.47,30.88) 11.5,30.06
  Bottom Layer w1.016: U5.17 30.86,9.94 arc(30.44,10.95) v1(29.44,11.37) ; U7.2 v1(3.05,34.25) U7.3 ; C16.2 C17.2 arc(24.38,16.16) 25.91,19.84 25.91,23.58 arc(25.42,24.75) 24.26,25.23 18.54,25.23 arc(17.64,24.86) 17.27,23.96 arc(16.9,23.08) 16.02,22.71 U3.3 13.04,22.15 arc(12.98,22) v1(12.83,21.93)
+5VIN: length 42.9
  Bottom Layer w1.016: 23.37,8.22 21.46,8.22 arc(21.28,8.14) 21.21,7.96 arc(21.17,7.75) 21.07,7.57 arc(20.98,7.5) 20.9,7.42 arc(20.75,7.35) 20.57,7.33 5.59,7.33 arc(3.82,8.06) 3.09,9.83 3.09,30.54
GND: length 34.9
  Top Layer w0.254: C9.1 v2(36.96,8.72) ; C4.1 14.29,19.84 v2(14.73,19.39) ; C1.1 v2(11.81,32.85) ; LED3.3 35.85,39.63 36.39,40.16 v2(36.77,40.16) ; LED7.3 11.09,15.5 v2(11.43,15.84) ; LED4.3 40.8,23.53 v2(39.8,23.53) ; LED6.3 16.09,21.89 v2(15.88,21.68) ; LED2.3 22.92,38.32 v2(22.35,38.32) ; C3.1 37.58,32.78 v2(36.91,32.78) ; C7.1 12.89,7.39 13.54,6.74 14.65,6.74 14.8,6.59 15.34,6.59 v2(15.74,6.19) ; LED5.3 v2(29.59,23.48) ; LED8.3 v2(24.51,14.42) ; LED9.3 v2(34.8,14.42) ; C8.1 25.34,9.55 v2(25.4,9.61) ; LED1.3 v2(12.19,38.8)
  Bottom Layer w0.254: 17.65,13.23 17.78,13.1 v2(18.36,13.1) ; 35.38,37.55 v2(34.16,37.55) ; 20.7,13.23 v2(21.46,13.23) ; v2(9.53,27.52) 9.26,27.25 U1.9 ; v2(18.44,10.31) C19.1 ; C21.1 v2(11.94,15.33) ; 20.69,5.48 21.46,6.25 USBC1.A12 ; C18.1 v2(20.83,10.31) ; C20.1 v2(14.61,15.33) ; 29.34,5.48 28.58,6.25 USBC1.A1 ; v2(46.44,39.46) 46.51,39.52 C15.1 ; U5.18 v2(29.46,9.12) ; SW2.2 v2(37.72,1.87)
ASR_RXD: length 16.4
  Bottom Layer w0.254: U5.15 35.94,12.79 37.15,14 arc(37.33,14.08) 37.51,14 37.98,13.54 arc(38.34,13.54) 38.34,13.89 37.87,14.36 arc(37.87,14.72) 38.23,14.72 38.7,14.25 arc(39.06,14.25) 39.06,14.61 38.59,15.08 arc(38.59,15.44) 38.95,15.44 39.42,14.97 arc(39.78,14.97) 39.78,15.33 39.31,15.8 arc(39.23,15.98) 39.31,16.16 39.62,16.47 U8.1
ASR_TXD: length 16.6
  Bottom Layer w0.254: U8.2 39.12,19.01 38.48,18.38 38.48,16.73 37.21,15.46 33.78,15.46 33.4,15.07 U5.16
CH340_RXD: length 38.7
  Bottom Layer w0.254: U2.3 33.91,35.01 32.89,36.03 32.89,36.54 31.01,38.42 26.57,38.42 25.53,39.46 25.53,42 25.15,42.38 18.37,42.38 arc(18.19,42.31) 18.12,42.13 18.12,42 arc(17.86,41.74) 17.61,42 17.61,42.13 arc(17.36,42.38) 17.1,42.13 17.1,42 arc(16.85,41.74) 16.59,42 16.59,42.13 arc(16.34,42.38) 16.09,42.13 16.09,42 arc(15.83,41.74) 15.58,42 15.58,42.13 arc(15.32,42.38) 15.07,42.13 15.07,42 arc(14.82,41.74) 14.56,42 14.56,42.13 arc(14.31,42.38) 14.05,42.13 14.05,42 arc(13.8,41.74) 13.55,42 13.55,42.13 arc(13.29,42.38) 13.04,42.13 13.04,42 arc(12.78,41.74) 12.53,42 12.53,42.13 arc(12.28,42.38) 12.02,42.13 12.02,42 arc(11.77,41.74) 11.51,42 11.51,42.13 arc(11.44,42.31) 11.26,42.38 10.67,42.38 9.54,41.25 U1.16
CH340_TXD: length 38.7
  Bottom Layer w0.254: U1.15 7.83,39.2 6.35,39.2 5.84,39.71 5.84,42 6.73,42.89 25.27,42.89 25.93,42.23 25.93,39.71 26.82,38.82 31.24,38.82 33.78,36.28 U2.2
CH340_USB+: length 46.1
  Top Layer w0.254: v2(34.77,25.3) 34.77,27.38 v2(33.53,28.62)
  Bottom Layer w0.254: v2(34.77,25.3) 34.77,22.66 32.64,20.54 32.64,5.17 30.86,3.39 25.02,3.39 24.27,4.14 24.27,5.27 ; USBC1.A6 25.27,6.24 25.27,5.28 25.02,5.03 24.51,5.03 24.27,5.27 ; 24.27,5.27 USBC1.B6 ; U2.5 36.19,32.47 36.7,31.97 36.7,30.95 36.32,30.57 34.04,30.57 33.53,30.06 v2(33.53,28.62)
CH340_USB-: length 46.3
  Top Layer w0.254: v2(32.51,28.66) 34.18,26.99 v2(34.18,24.55)
  Bottom Layer w0.254: v2(34.18,24.55) 34.18,22.97 31.62,20.41 31.62,19.64 arc(31.68,19.51) 31.81,19.45 arc(31.95,19.4) 32,19.26 32,19.13 arc(31.95,19) 31.81,18.94 arc(31.68,18.89) 31.62,18.75 31.62,18.63 arc(31.68,18.49) 31.81,18.44 arc(31.95,18.38) 32,18.25 32,18.12 arc(31.95,17.98) 31.81,17.93 arc(31.68,17.87) 31.62,17.74 31.62,17.61 arc(31.68,17.48) 31.81,17.42 arc(31.95,17.36) 32,17.23 32,17.1 arc(31.95,16.97) 31.81,16.91 arc(31.68,16.86) 31.62,16.72 31.62,16.59 arc(31.68,16.46) 31.81,16.4 arc(31.95,16.35) 32,16.21 32,16.09 arc(31.95,15.95) 31.81,15.9 arc(31.68,15.84) 31.62,15.71 31.62,15.58 arc(31.68,15.44) 31.81,15.39 arc(31.95,15.33) 32,15.2 32,15.07 arc(31.95,14.94) 31.81,14.88 arc(31.68,14.82) 31.62,14.69 31.62,14.56 arc(31.68,14.43) 31.81,14.37 arc(31.95,14.32) 32,14.18 32,14.05 arc(31.95,13.92) 31.81,13.86 arc(31.68,13.81) 31.62,13.67 31.62,13.55 arc(31.68,13.41) 31.81,13.36 arc(31.95,13.3) 32,13.17 32,13.04 arc(31.95,12.9) 31.81,12.85 arc(31.68,12.79) 31.62,12.66 31.62,12.53 arc(31.68,12.4) 31.81,12.34 arc(31.95,12.28) 32,12.15 32,12.02 arc(31.95,11.89) 31.81,11.83 arc(31.68,11.78) 31.62,11.64 31.62,11.51 arc(31.68,11.38) 31.81,11.32 arc(31.95,11.27) 32,11.13 32,11.01 arc(31.95,10.87) 31.81,10.82 arc(31.68,10.76) 31.62,10.63 31.62,4.79 30.73,3.9 26.29,3.9 25.77,4.42 USBC1.B7 25.78,6.26 25.78,7.21 25.57,7.42 24.99,7.42 24.77,7.2 USBC1.A7 ; v2(32.51,28.66) 32.51,30.82 33.02,31.33 35.13,31.33 35.38,31.08
DTR: length 29.4
  Top Layer w0.254: v2(37.9,28.03) 39.75,28.03 41.28,29.55 41.28,32.08 v2(41.29,32.09)
  Bottom Layer w0.254: v2(41.29,32.09) Q1.2 41.98,32.66 42.29,32.35 42.29,30.19 42.55,29.93 46.61,29.93 46.99,30.31 47.36,30.31 R5.1 ; v2(37.9,28.03) 31.87,28.03 31.24,28.66 31.24,33.49 30.99,33.74 U2.13
IO0: length 99.9
  Top Layer w0.254: v2(37.72,4.15) 40.89,4.15 42.8,6.06 42.8,21.55 44.58,23.33 44.58,31.31 v2(44.2,31.69) ; v2(34.54,9.87) 33.9,9.87 31.48,12.28 v2(30.23,12.28) ; v2(8,25.23) 8.38,24.85 8.38,11.27 9.27,10.38 v2(12.83,10.38)
  Bottom Layer w0.254: U1.12 6.49,33.25 6.22,32.98 6.22,26.12 7.11,25.23 v2(8,25.23) ; v2(44.2,31.69) 43.31,31.69 Q1.3 ; v2(37.72,4.15) SW2.1 37.72,6.95 37.54,7.13 35.51,7.13 34.54,8.09 v2(34.54,9.87) ; v2(30.23,12.28) 16.51,12.28 16,12.79 16,13.42 15.49,13.93 13.59,13.93 12.89,13.23 11.94,13.23 R3.2 12.82,10.37 v2(12.83,10.38)
IO4: length 39.1
  Top Layer w0.254: v2(5.59,29.04) 9.91,29.04 10.8,28.16 11.27,28.16 arc(11.36,28.19) 11.4,28.28 arc(11.43,28.37) 11.52,28.41 11.78,28.41 arc(11.87,28.37) 11.9,28.28 arc(11.94,28.19) 12.03,28.16 12.28,28.16 arc(12.37,28.19) 12.41,28.28 arc(12.45,28.37) 12.54,28.41 12.79,28.41 arc(12.88,28.37) 12.92,28.28 arc(12.96,28.19) 13.05,28.16 13.3,28.16 arc(13.39,28.19) 13.43,28.28 arc(13.47,28.37) 13.56,28.41 13.81,28.41 arc(13.9,28.37) 13.94,28.28 arc(13.97,28.19) 14.06,28.16 30.48,28.16 v2(30.99,27.65)
  Bottom Layer w0.254: v2(5.59,29.04) 5.33,29.3 5.33,34.25 6.35,35.27 7.86,35.27 U1.13 ; U5.3 33.4,26.76 32.51,27.65 v2(30.99,27.65)
IO5: length 39
  Top Layer w0.254: v2(5.21,28.28) 9.78,28.28 10.54,27.52 v2(27.94,27.52)
  Bottom Layer w0.254: v2(5.21,28.28) 4.83,28.66 4.83,36.03 6.05,37.25 U1.14 ; U5.2 30.86,26.76 30.1,27.52 v2(27.94,27.52)
IO15: length 12.7
  Top Layer w1.016: LED1.4 v1(12.8,35.8) arc(12.82,35.79) 12.83,35.78
  Bottom Layer w1.016: 12.83,35.78 12.83,30.57 arc(12.44,29.64) 11.51,29.25 U1.10
RST: length 115
  Top Layer w0.254: v2(43.43,37.05) 43.81,36.66 43.81,32.14 43.61,31.94 43.61,31.45 43.81,31.25 v2(43.81,27.39) 43.81,23.33 43.43,22.95 v2(43.18,22.95) ; v2(22.22,41.24) 26.77,41.24 27.79,42.25 37.34,42.25 37.97,42.89 47.24,42.89 49.06,41.08 49.06,35.14 48.42,34.51 46.86,34.51 46.36,35.01 46.36,36.25 v2(46.33,36.27) ; v2(14.4,4.15) 14.4,5.75 13.77,6.39 12.24,6.39 11.68,6.95 11.68,9.36 12.06,9.74 13.22,9.74 v2(13.84,10.37) 13.84,15.58 14.35,16.09 v2(34.54,16.09)
  Bottom Layer w0.254: 14.61,13.23 R2.2 v2(13.84,10.37) ; v2(34.54,16.09) 37.08,16.09 37.97,16.98 37.97,22.06 38.86,22.95 v2(43.18,22.95) ; U1.1 23.86,41.24 v2(22.22,41.24) ; v2(14.4,4.15) 14.4,5.27 SW1.1 ; v2(46.33,36.27) 46.36,36.3 46.36,36.79 45.59,37.55 Q2.3 43.43,37.28 v2(43.43,37.05)
RTS: length 46.4
  Top Layer w0.254: v2(27.18,35.01) 26.42,35.78 26.42,38.82 27.43,39.84 35.56,39.84 38.1,42.38 47.12,42.38 48.54,40.96 48.54,35.55 v2(48.26,35.27)
  Bottom Layer w0.254: U2.14 v2(27.18,35.01) ; v2(48.26,35.27) 48.25,35.26 R4.1 47.5,35.39 42.67,35.39 42.16,35.9 42.16,38.19 41.85,38.5 Q2.2
$1N1426: length 9.2
  Top Layer w1.016: LED8.4 21.31,11.42 arc(20.25,11.86) 19.81,12.92 arc(19.37,13.98) 18.31,14.42 LED7.2
$1N1428: length 14.3
  Top Layer w1.016: LED6.2 10.69,23.48 arc(9.69,23.06) 9.27,22.06 9.27,13.23 arc(9.8,11.95) LED7.4
$1N1430: length 14.4
  Top Layer w1.016: LED4.4 41.25,26.48 arc(42.08,26.82) 42.42,27.65 42.42,37.36 arc(41.96,38.47) LED3.2
$1N1444: length 9
  Top Layer w1.016: LED9.4 34.01,11.42 arc(32.95,11.86) 32.51,12.92 arc(32.07,13.98) 31.01,14.42 LED8.2
$1N1450: length 9.2
  Top Layer w1.016: LED5.2 21.19,23.48 arc(20.12,23.92) 19.69,24.98 arc(19.25,26.04) 18.19,26.48 LED6.4
$1N1453: length 9
  Top Layer w1.016: LED4.2 33.76,23.48 arc(32.7,23.92) 32.26,24.98 arc(31.82,26.04) 30.76,26.48 LED5.4
$1N1461: length 9.1
  Top Layer w1.016: LED2.4 21.06,35.93 arc(20.09,36.33) 19.69,37.3 arc(19.25,38.36) 18.19,38.8 LED1.2
$1N1466: length 9
  Top Layer w1.016: LED2.2 30.76,38.93 arc(31.82,38.49) 32.26,37.43 arc(32.7,36.37) 33.76,35.93 LED3.4
$1N2556: length 13.3
  Bottom Layer w0.254: Q1.1 41.29,29.92 41.78,29.43 48.08,29.43 48.59,29.93 48.59,33.41 48.34,33.67 47.45,33.67
$1N2557: length 10.2
  Bottom Layer w0.254: 41.16,36.6 41.16,35.38 41.53,35.01 45.97,35.01 46.36,34.63 46.36,32.47 46.86,31.97 47.49,31.97 R5.2
$1N4217: length 46.7
  Bottom Layer w0.254: MIC1.1 38.35,45.36 38.35,43.65 39.24,42.76 47.37,42.76 49.02,41.11 49.02,27.9 47.5,26.38 47.5,11.27 46.1,9.87 U5.11
$1N4222: length 46.7
  Bottom Layer w0.254: MIC1.2 40.26,45.37 40.26,43.65 40.64,43.27 47.5,43.27 49.53,41.24 49.53,22.79 arc(49.46,22.61) 49.28,22.53 49.02,22.53 arc(48.77,22.28) 49.02,22.03 49.28,22.03 arc(49.53,21.77) 49.28,21.52 49.02,21.52 arc(48.77,21.26) 49.02,21.01 49.28,21.01 arc(49.46,20.94) 49.53,20.76 49.53,10.76 48.64,9.87 U5.10
$1N4406: length 35.5
  Top Layer w0.254: v2(46.36,24.24) v2(48.26,24.24)
  Bottom Layer w0.254: v2(48.26,24.24) 48.26,24.35 48.64,24.73 U5.9 ; v2(46.36,24.24) 45.95,23.84 40.7,23.84 39.88,24.66 39.88,26.18 38.84,27.23 38.84,38.15 37.82,39.17 31.72,39.17 31.68,39.2 29.97,39.2 29.48,39.7 U6.2
$1N4408: length 35.7
  Bottom Layer w0.254: U5.8 46.1,24.98 45.47,24.35 40.76,24.35 40.29,24.82 40.29,26.34 39.75,26.89 39.75,27.41 arc(39.83,27.59) 40,27.66 40.19,27.66 arc(40.44,27.92) 40.19,28.17 40,28.17 arc(39.75,28.43) 40,28.68 40.19,28.68 arc(40.44,28.93) 40.19,29.19 40,29.19 arc(39.75,29.44) 40,29.7 40.19,29.7 arc(40.44,29.95) 40.19,30.2 40,30.2 arc(39.75,30.46) 40,30.71 40.13,30.71 arc(40.39,30.97) 40.13,31.22 40,31.22 arc(39.75,31.47) 40,31.73 40.19,31.73 arc(40.44,31.98) 40.19,32.24 40,32.24 arc(39.75,32.49) 40,32.74 40.13,32.74 arc(40.39,33) 40.13,33.25 40,33.25 arc(39.83,33.33) 39.75,33.51 39.75,37.81 37.99,39.57 31.89,39.57 31.48,39.98 U6.1

## Copper pours and planes (outline as drawn; the poured copper is in the pictures)
+5VIN on Bottom Layer: 22.32,8.47 27.69,8.47 27.69,5.84 22.32,5.84
GND on Top Layer: -8.89,53.17 59.06,53.17 59.06,-2.96 -8.89,-2.96
GND on Bottom Layer: -10.03,59.4 60.07,59.4 60.07,-8.8 -10.03,-8.8

Small or netless copper shapes (teardrops, artwork), in the pictures only: 65 on Top Layer, 117 on Bottom Layer

## Text on the board
Bottom Silkscreen Layer: O+ | IN+ | LED | GND | -spk+ | 重启 | 烧录
Top Solder Mask Layer: YUAXI
Top Silkscreen Layer: RTG | ᐁ
